# Altium schematic sheet [04] - KEYS.SchDoc
size A4
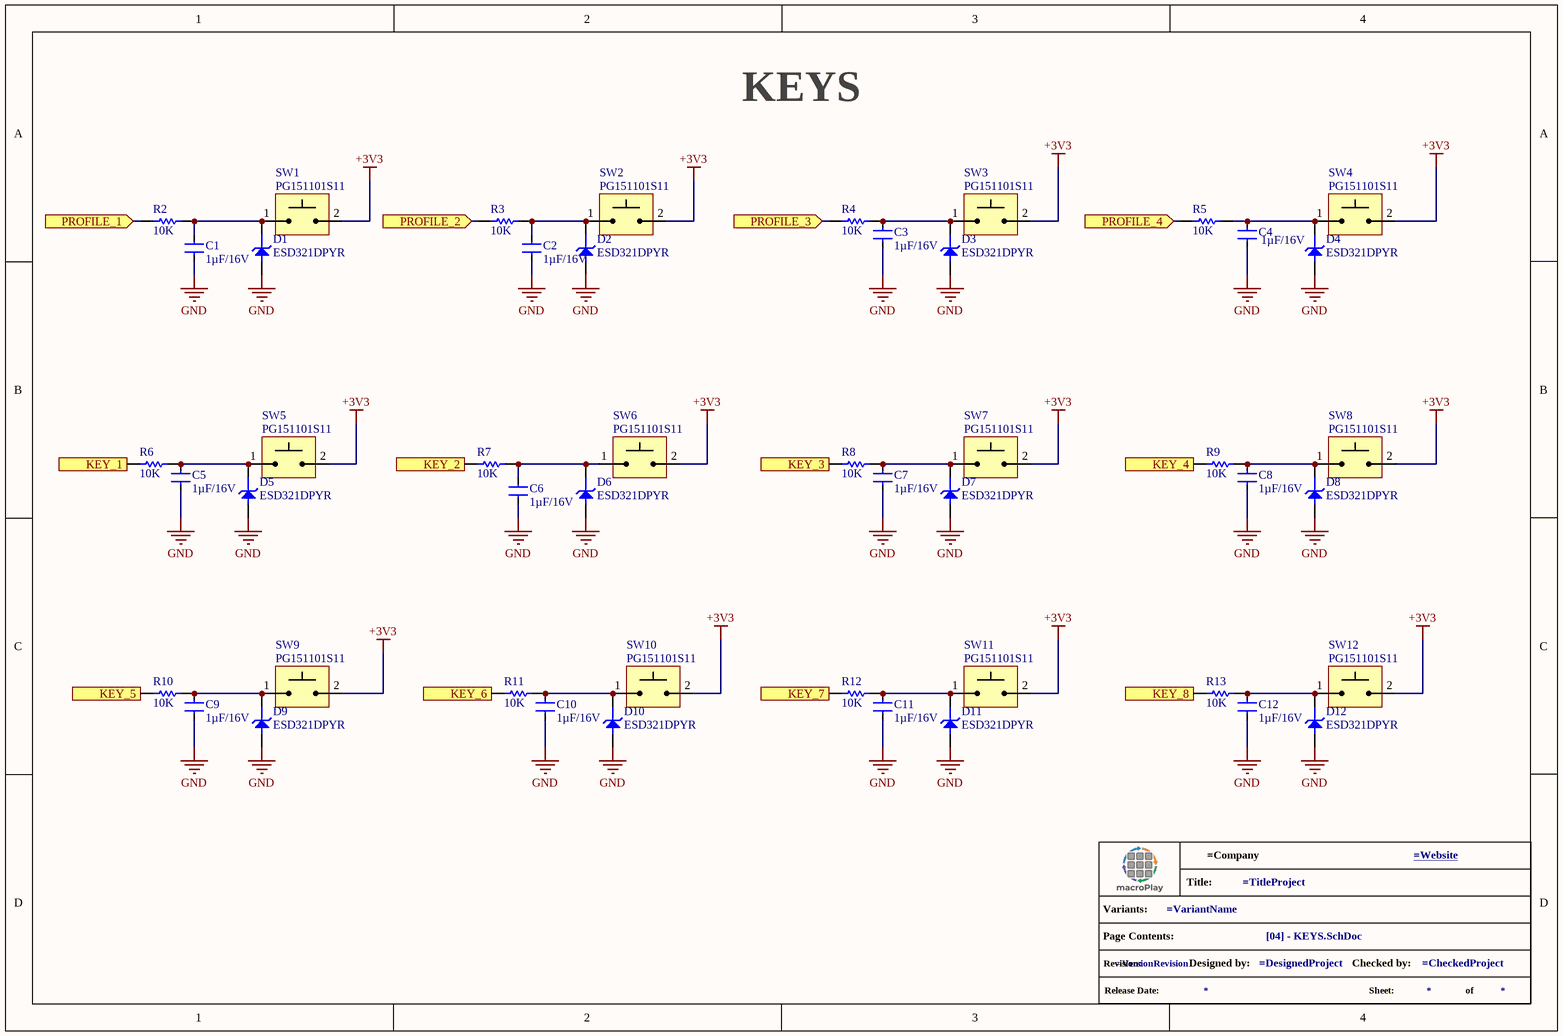
[diagram p0: [04] - KEYS.SchDoc]

## Parts
C1  1µF/16V  [C0402 - Iron Soldering]
C2  1µF/16V  [C0402 - Iron Soldering]
C3  1µF/16V  [C0402 - Iron Soldering]
C4  1µF/16V  [C0402 - Iron Soldering]
C5  1µF/16V  [C0402 - Iron Soldering]
C6  1µF/16V  [C0402 - Iron Soldering]
C7  1µF/16V  [C0402 - Iron Soldering]
C8  1µF/16V  [C0402 - Iron Soldering]
C9  1µF/16V  [C0402 - Iron Soldering]
C10  1µF/16V  [C0402 - Iron Soldering]
C11  1µF/16V  [C0402 - Iron Soldering]
C12  1µF/16V  [C0402 - Iron Soldering]
D1  ESD321DPYR  [ESD321DPYR]
D2  ESD321DPYR  [ESD321DPYR]
D3  ESD321DPYR  [ESD321DPYR]
D4  ESD321DPYR  [ESD321DPYR]
D5  ESD321DPYR  [ESD321DPYR]
D6  ESD321DPYR  [ESD321DPYR]
D7  ESD321DPYR  [ESD321DPYR]
D8  ESD321DPYR  [ESD321DPYR]
D9  ESD321DPYR  [ESD321DPYR]
D10  ESD321DPYR  [ESD321DPYR]
D11  ESD321DPYR  [ESD321DPYR]
D12  ESD321DPYR  [ESD321DPYR]
GPH?  info_project  (value not drawn)  (graphical)
R2  10K  [R0402 - IronSolder]
R3  10K  [R0402 - IronSolder]
R4  10K  [R0402 - IronSolder]
R5  10K  [R0402 - IronSolder]
R6  10K  [R0402 - IronSolder]
R7  10K  [R0402 - IronSolder]
R8  10K  [R0402 - IronSolder]
R9  10K  [R0402 - IronSolder]
R10  10K  [R0402 - IronSolder]
R11  10K  [R0402 - IronSolder]
R12  10K  [R0402 - IronSolder]
R13  10K  [R0402 - IronSolder]
SW1  PG151101S11  [SW_PG151101S11]
SW2  PG151101S11  [SW_PG151101S11]
SW3  PG151101S11  [SW_PG151101S11]
SW4  PG151101S11  [SW_PG151101S11]
SW5  PG151101S11  [SW_PG151101S11]
SW6  PG151101S11  [SW_PG151101S11]
SW7  PG151101S11  [SW_PG151101S11]
SW8  PG151101S11  [SW_PG151101S11]
SW9  PG151101S11  [SW_PG151101S11]
SW10  PG151101S11  [SW_PG151101S11]
SW11  PG151101S11  [SW_PG151101S11]
SW12  PG151101S11  [SW_PG151101S11]

## Ports
KEY_1 (in), KEY_2 (in), KEY_3 (in), KEY_4 (in), KEY_5 (in), KEY_6 (in), KEY_7 (in), KEY_8 (in), PROFILE_1 (in), PROFILE_2 (in), PROFILE_3 (in), PROFILE_4 (in)

## Nets
+3V3: SW1.2 SW2.2 SW3.2 SW4.2 SW5.2 SW6.2 SW7.2 SW8.2 SW9.2 SW10.2 SW11.2 SW12.2
GND: C1.1 C2.1 C3.1 C4.1 C5.1 C6.1 C7.1 C8.1 C9.1 C10.1 C11.1 C12.1 D1.2 D2.2 D3.2 D4.2 D5.2 D6.2 D7.2 D8.2 D9.2 D10.2 D11.2 D12.2
KEY_1: R6.2 ; port KEY_1
KEY_2: R7.2 ; port KEY_2
KEY_3: R8.2 ; port KEY_3
KEY_4: R9.2 ; port KEY_4
KEY_5: R10.2 ; port KEY_5
KEY_6: R11.2 ; port KEY_6
KEY_7: R12.2 ; port KEY_7
KEY_8: R13.2 ; port KEY_8
PROFILE_1: R2.2 ; port PROFILE_1
PROFILE_2: R3.2 ; port PROFILE_2
PROFILE_3: R4.2 ; port PROFILE_3
PROFILE_4: R5.2 ; port PROFILE_4
NetC1_2: C1.2 D1.1 R2.1 SW1.1
NetC2_2: C2.2 D2.1 R3.1 SW2.1
NetC3_2: C3.2 D3.1 R4.1 SW3.1
NetC4_2: C4.2 D4.1 R5.1 SW4.1
NetC5_2: C5.2 D5.1 R6.1 SW5.1
NetC6_2: C6.2 D6.1 R7.1 SW6.1
NetC7_2: C7.2 D7.1 R8.1 SW7.1
NetC8_2: C8.2 D8.1 R9.1 SW8.1
NetC9_2: C9.2 D9.1 R10.1 SW9.1
NetC10_2: C10.2 D10.1 R11.1 SW10.1
NetC11_2: C11.2 D11.1 R12.1 SW11.1
NetC12_2: C12.2 D12.1 R13.1 SW12.1

## Notes on the sheet
- KEYS
- (in symbol info_project) Title:; Variants:; Page Contents:; Revision:; Designed by:; Checked by:; Release Date:; Sheet:; of

## Library data of the parts
C1-C12 = EMK105BJ105KV-F: MLCC - 1µF 16V 0402 X5R ±10%.; Manufacturer 1: Taiyo Yuden; Dielectric Material: Ceramic; Value: 1uF; Multilayer: Yes; Tolerance  (fill in as +-): 10%; .Mounting: SMT; Supplier 1: Avnet; Supplier Part Number 1: 84R9109; Manufacturer Part Number 1: EMK105BJ105KV-F; RoHS: Yes; Category: Ceramic Capacitors; Stock: 100000; Pricing: 10000=0,007, 20000=0,008 (USD); Mounting Technology: Surface Mount; Pins: 2; Package Shape: Rectangular; Case/Package: 0402; Terminal Finish: Nickel; Min Operating Temperature: -55°C; Max Operating Temperature: 85°C; JESD-609 Code: e3; Capacitor Type: Ceramic; Package Style: SMTMeter; Packaging: Tape and Reel; Tolerance (fill in as +-): 10%; Rated DC Voltage (URdc): 16V; Temperature Characteristics Code: X5R; Termination: Wraparound; Length: 1mm; Width: 0.5mm; Height: 0.5mm; Reach SVHC Compliant: Yes; RoHS Compliant: Yes; ComponentLink1URL: https://datasheet.ciiva.com:443/pdfs/VipMasterIC/IC/TAIY/TAIY-S-A0009096450/TAIY-S-A0009096597-1.pdf?src-supplier=IHS+Markit; ComponentLink1Description: https://datasheet.ciiva.com:443/pdfs/VipMasterIC/IC/TAIY/TAIY-S-A0009096450/TAIY-S-A0009096597-1.pdf?src-supplier=IHS+Markit; ComponentLink2URL: https://datasheet.ciiva.com/134/emk105bj105kv-f-ss-134209.pdf?src-supplier=Digikey; ComponentLink2Description: https://datasheet.ciiva.com/134/emk105bj105kv-f-ss-134209.pdf?src-supplier=Digikey; ComponentLink3URL: https://datasheet.ciiva.com/30259/265emk105bj105kv-f-30259872.pdf?src-supplier=Onlinecomponents.com; ComponentLink3Description: https://datasheet.ciiva.com/30259/265emk105bj105kv-f-30259872.pdf?src-supplier=Onlinecomponents.com; ComponentLink4URL: https://datasheet.ciiva.com/15920/964emk105bj105kv-f-15920402.pdf?src-supplier=Onlinecomponents.com; ComponentLink4Description: https://datasheet.ciiva.com/15920/964emk105bj105kv-f-15920402.pdf?src-supplier=Onlinecomponents.com; ComponentLink5URL: https://datasheet.ciiva.com/26871/getdatasheetpartid-638287-26871289.pdf?src-supplier=Verical; ComponentLink5Description: https://datasheet.ciiva.com/26871/getdatasheetpartid-638287-26871289.pdf?src-supplier=Verical; ComponentLink6URL: https://datasheet.ciiva.com/5424/mlcc01-e-5424190.pdf?src-supplier=Mouser; ComponentLink6Description: https://datasheet.ciiva.com/5424/mlcc01-e-5424190.pdf?src-supplier=Mouser; ComponentLink7URL: https://datasheet.ciiva.com/22694/1497285-22694239.pdf?src-supplier=Element14; ComponentLink7Description: https://datasheet.ciiva.com/22694/1497285-22694239.pdf?src-supplier=Element14; ComponentLink8URL: https://datasheet.ciiva.com/7657/1497285-7657320.pdf?src-supplier=Element14; ComponentLink8Description: https://datasheet.ciiva.com/7657/1497285-7657320.pdf?src-supplier=Element14; .PCBChecked: *; .SCHChecked: *
D1-D12 = ESD321DPYR: DIODE - TVS UNI-DIR 3.6V, 4.5V, 6.8V, 6A, 0.9pF.; Manufacturer 1: Texas Instruments; Description 1: ESD Suppressor Diode TVS Uni-Dir 3.6V 2-Pin X1SON T/R; Category 1: TVS Diodes; .Mouting: SMT; .SCHChecked: Lucas Vieira; RoHS Compliant: Yes; ComponentLink1URL: http://www.ti.com/general/docs/suppproductinfo.tsp?distId=10&amp;gotoUrl=http%3A%2F%2Fwww.ti.com%2Flit%2Fgpn%2Fesd321&src-supplier=Digi-Key; ComponentLink1Description: http://www.ti.com/general/docs/suppproductinfo.tsp?distId=10&amp;gotoUrl=http%3A%2F%2Fwww.ti.com%2Flit%2Fgpn%2Fesd321&src-supplier=Digi-Key; Supplier 1: Digi-Key; Supplier Part Number 1: 296-51108-1-ND; Manufacturer Part Number 1: ESD321DPYR; RoHS 1: Yes; Stock 1: 172519; Pricing 1: 1=0,37000, 10=0,29900, 100=0,20350, 500=0,15264, 1000=0,11448, 2000=0,10494, 5000=0,09858 (USD); Manufacturer 2: Texas Instruments; Manufacturer Part Number 2: ESD351DPYR; .PCBChecked: Lucas Vieira; Manufacturer 3: Panjit International Inc.; Manufacturer Part Number 3: PE1605M1Q_R1_00001; .Mounting: SMT
GPH? = info_project: GRAPHICAL - Info Project
R2-R13 = RC1005F103CS: RES - 10K 1/16W 0402 ±1% Chip Resistor; Manufacturer 1: Samsung; Power: 60mW; Value: 10kR; Working Voltage: 50V; Temperature Coefficient (ppm/Cel): 100; Package Height: 0.35mm; Package Length: 1mm; Package Width: 0.5mm; .Mounting: SMT; Supplier: Digikey; Supplier Part Number: 1276-3431-1-ND; Manufacturer Part Number 1: RC1005F103CS; RoHS: Yes; Category: Chip SMD Resistors; Stock: 10935408; Pricing: 1=0,1, 10=0,039, 100=0,0201, 1000=0,01175, 2500=0,0099, 5000=0,00882 (USD); Mounting Technology: Surface Mount; Pins: 2; Package Shape: Rectangular; Case/Package: 0402; Terminal Finish: Nickel; Min Operating Temperature: -55°C; Max Operating Temperature: 125°C; Tolerance: 1%; JESD-609 Code: e3; Resistor Type: FIXED RESISTOR; Construction: Chip; Packaging: Tape and Reel; Technology: METAL GLAZE/THICK FILM; Reach SVHC Compliant: Yes; RoHS Compliant: Yes; ComponentLink1URL: https://datasheet.ciiva.com:443/pdfs/VipMasterIC/IC/SEMS/SEMS-S-A0001326806/SEMS-S-A0001326806-1.pdf?src-supplier=IHS+Markit; ComponentLink1Description: https://datasheet.ciiva.com:443/pdfs/VipMasterIC/IC/SEMS/SEMS-S-A0001326806/SEMS-S-A0001326806-1.pdf?src-supplier=IHS+Markit; ComponentLink2URL: https://datasheet.ciiva.com/15196/getdatasheetpartid-504789-15196214.pdf?src-supplier=Verical; ComponentLink2Description: https://datasheet.ciiva.com/15196/getdatasheetpartid-504789-15196214.pdf?src-supplier=Verical; ComponentLink3URL: https://datasheet.ciiva.com/16481/rcseries-16481007.pdf?src-supplier=Future+Electronics; ComponentLink3Description: https://datasheet.ciiva.com/16481/rcseries-16481007.pdf?src-supplier=Future+Electronics; .PCBChecked: *; .SCHChecked: *
SW1-SW12 = PG151101S11: SWITCH - Kailh socket for hotswap mechanical switches; .Mounting: SMD; SnapEDA_Link: https://www.snapeda.com/parts/PG151101S11/Kailh/view-part/?ref=snap; Package: Package; Value: *; MF: Kailh; MP: PG151101S11; Check_prices: https://www.snapeda.com/parts/PG151101S11/Kailh/view-part/?ref=eda; .PCBChecked: *; .SCHChecked: *